# EAGLE design DRV8835-28BYJ (EAGLE 9.6.2)
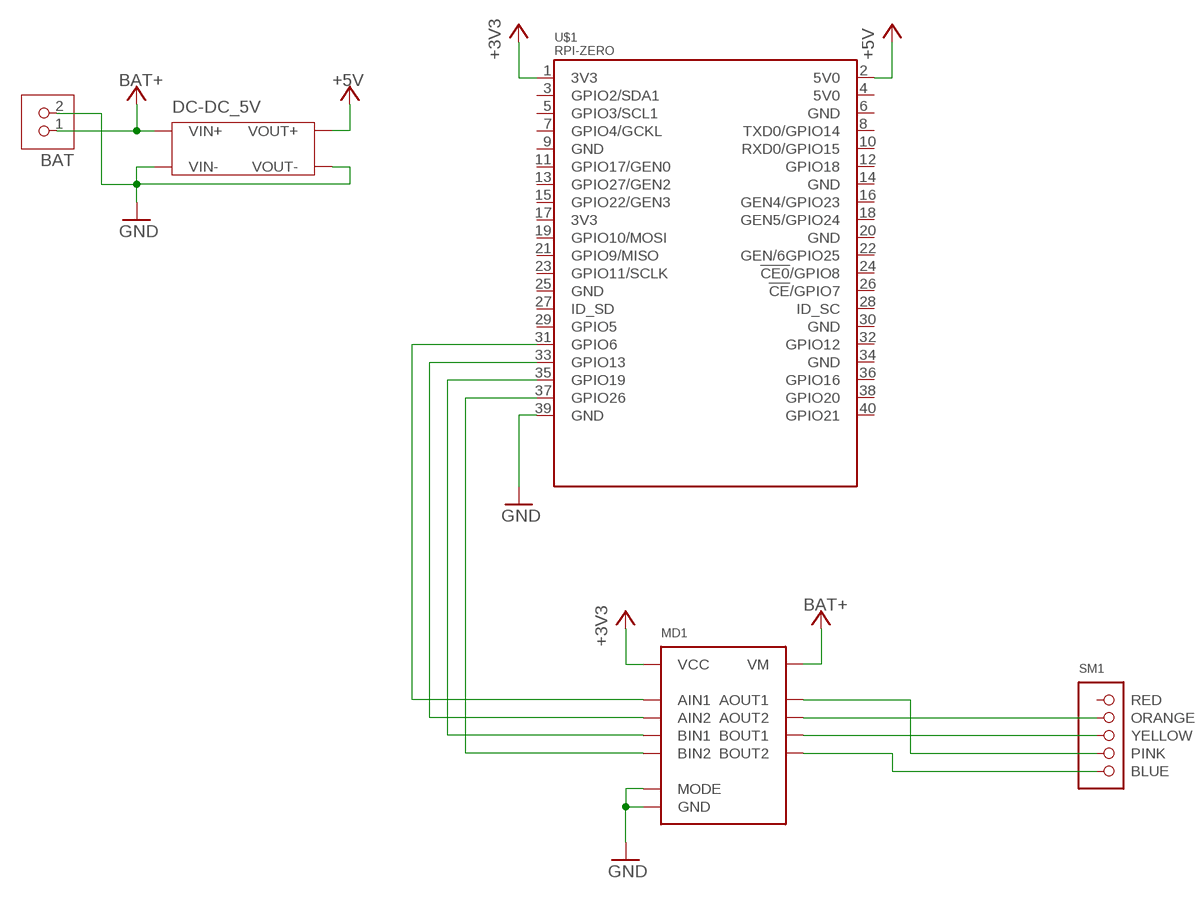
[diagram p0: schematic, sheet 1]

## Parts
BAT  JST-PH2  [JST-PH2]
DC-DC_5V  DCDC-5V_28V-2A  [DCDC-5V_28V-2A]
MD1  DRV8835MOD  [DRV8835MOD]
SM1  28BYJ-48-5V  [28BYJ-48-5V]
U$1  RPI-ZERO  [RASPBERRYPI_BASTELSTUBE_V13_RASPI_BOARD_B+_FULL]

## Nets
+3V3: MD1.VCC U$1.1(3V3)
+5V: DC-DC_5V.VOUT+ U$1.2(5V0)
BAT+: BAT.1 DC-DC_5V.VIN+ MD1.VM
BLUE: MD1.BOUT2 SM1.BLUE
GND: BAT.2 DC-DC_5V.VIN- DC-DC_5V.VOUT- MD1.GND MD1.MODE U$1.39(GND)
GPIO6: MD1.AIN1 U$1.31(GPIO6)
GPIO13: MD1.AIN2 U$1.33(GPIO13)
GPIO19: MD1.BIN1 U$1.35(GPIO19)
GPIO26: MD1.BIN2 U$1.37(GPIO26)
ORANGE: MD1.AOUT2 SM1.ORANGE
PINK: MD1.AOUT1 SM1.PINK
YELLOW: MD1.BOUT1 SM1.YELLOW
Unconnected: SM1.RED U$1.3(GPIO2/SDA1) U$1.4(5V0) U$1.5(GPIO3/SCL1) U$1.6(GND) U$1.7(GPIO4/GCKL) U$1.8(TXD0/GPIO14) U$1.9(GND) U$1.10(RXD0/GPIO15) U$1.11(GPIO17/GEN0) U$1.12(GPIO18) U$1.13(GPIO27/GEN2) U$1.14(GND) U$1.15(GPIO22/GEN3) U$1.16(GEN4/GPIO23) U$1.17(3V3) U$1.18(GEN5/GPIO24) U$1.19(GPIO10/MOSI) U$1.20(GND) U$1.21(GPIO9/MISO) U$1.22(GEN/6GPIO25) U$1.23(GPIO11/SCLK) U$1.24(!CE0!/GPIO8) U$1.25(GND) U$1.26(!CE!/GPIO7) U$1.27(ID_SD) U$1.28(ID_SC) U$1.29(GPIO5) U$1.30(GND) U$1.32(GPIO12) U$1.34(GND) U$1.36(GPIO16) U$1.38(GPIO20) U$1.40(GPIO21)

## Library data of the parts
BAT = ytani1:JST-PH2
DC-DC_5V = ytani1:DCDC-5V_28V-2A: Step-Up DC/DC converter https://www.amazon.co.jp/gp/product/B01D0WSBGY/ In 2V-24V Out 5V-28V = [VALUE] Max: 2A (1A recomended); URL_AMAZON: https://www.amazon.co.jp/gp/product/B01D0WSBGY/
MD1 = ytani1:DRV8835MOD: DRV8835 Motor Driver Module https://akizukidenshi.com/catalog/g/gK-09848/ Vcc = 2V-7V Vm = 0V-11V Iout = 0V-1.5A Fpwm = 0Hz-250kHz Vin = 0V-Vcc; OC_AKIZUKI: K-09848
SM1 = ytani1:28BYJ-48-5V
U$1 = RPI-Zero:RPI-ZERO

## Board
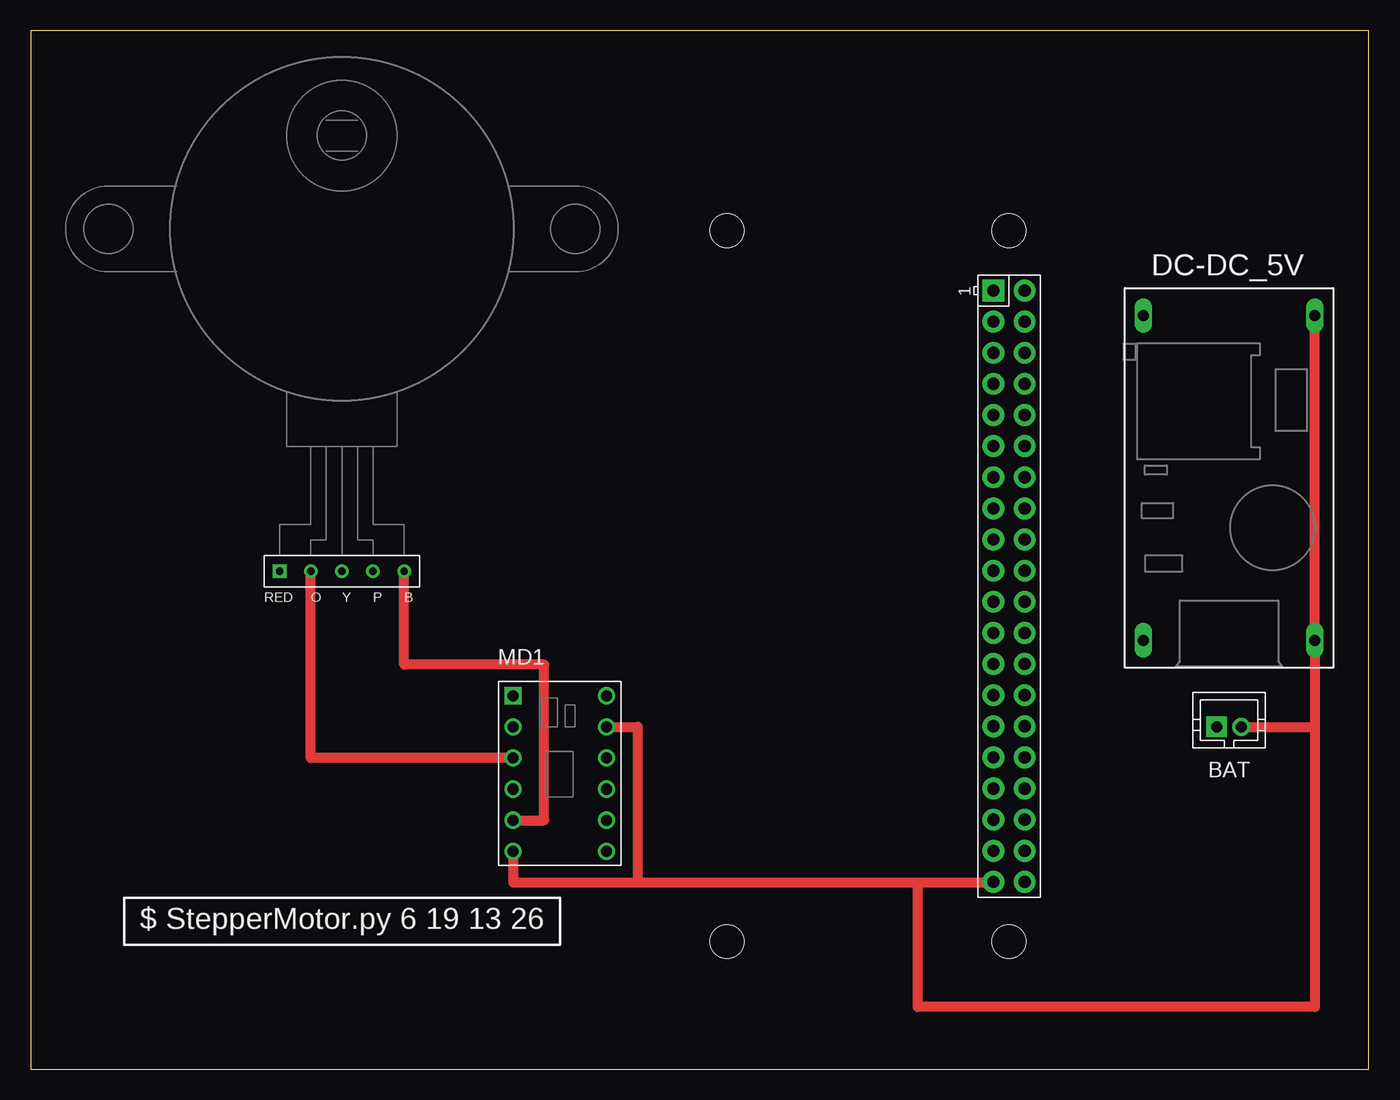
[diagram p1: board, top side]
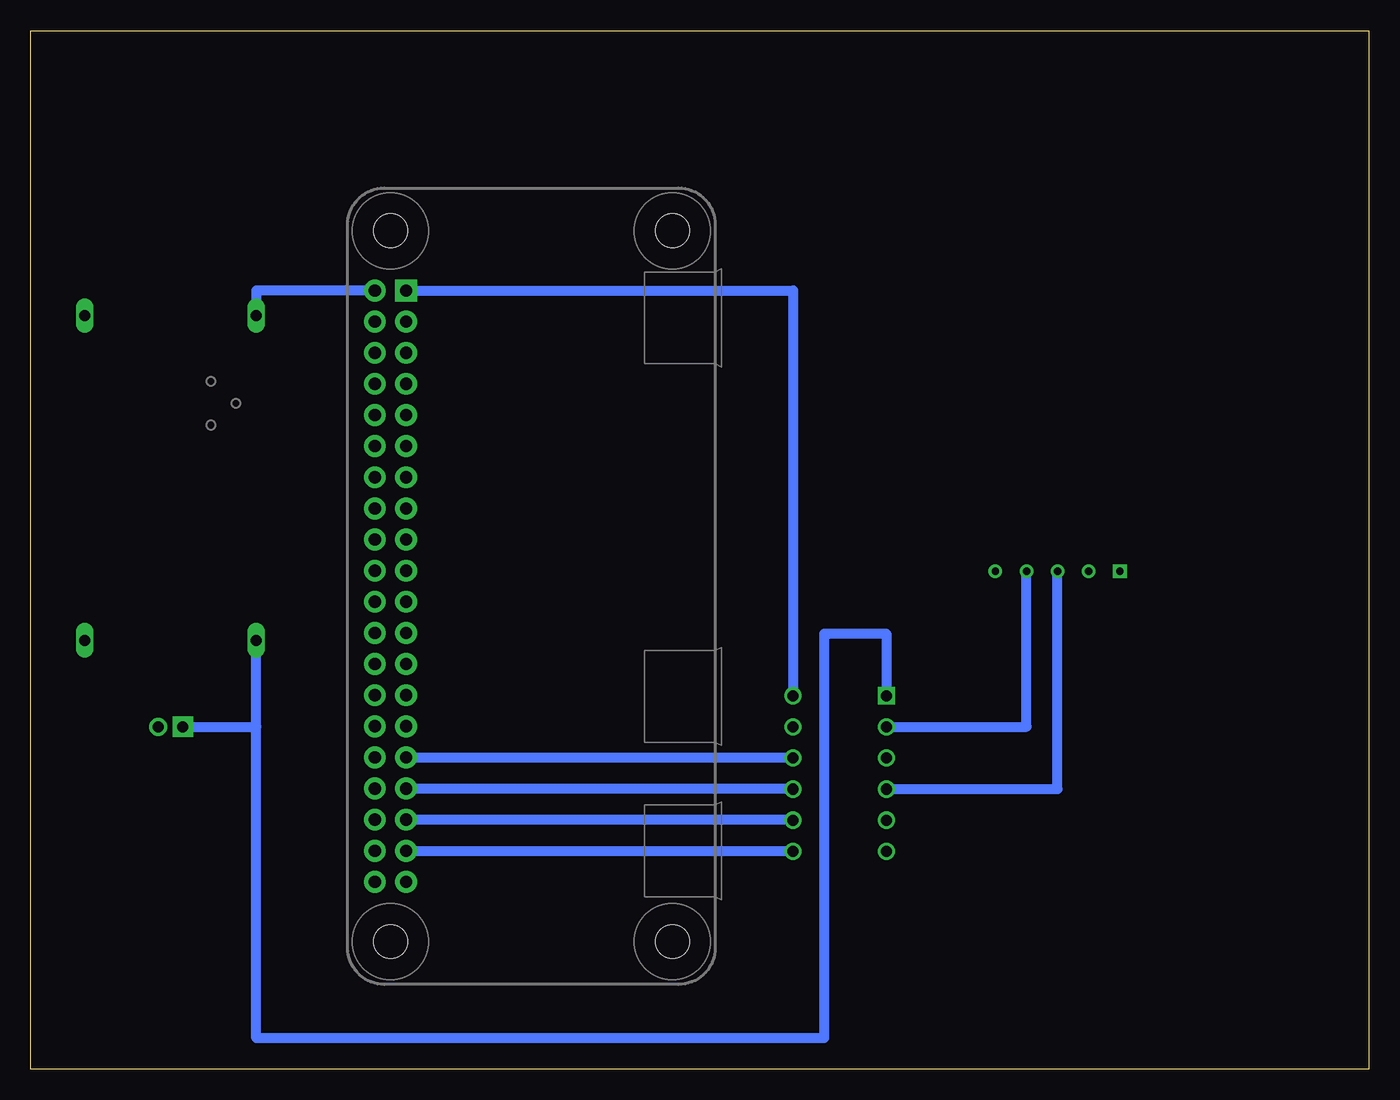
[diagram p2: board, bottom side, seen from below]

Size 109.2 x 84.76 mm. Coordinates in mm from the lower left corner, seen from the top.
Outline: 0,0 109.2,0 109.2,84.76 0,84.76 0,0
Copper layers (1*16): Top 0.035mm / dielectric 1.5mm / Bottom 0.035mm
Design rules "default": minimum track width 6mil, minimum drill 0.35mm, track to track 6mil, track to pad 6mil, pad to pad 6mil, via to via 6mil, smd to smd 6mil, copper to edge 40mil, drill to drill 6mil, minimum pad ring 10mil, minimum via ring 8mil, stop-mask expansion 4mil, vias tented up to drill 0mil, thermal gap 10mil

### Footprints (pad centres in the part's own frame; a part is rotated, then mirrored left to right if it is on the bottom)
JST-PH2 = drill 0.9 pad 1.676 square: 1 -1,0 | drill 0.9 pad 1.5: 2 1,0
DCDC-5V_28V-2A = drill 0.9 long: VIN+ -13.25,7; VIN- -13.25,-7; VOUT+ 13.25,7; VOUT- 13.25,-7
DRV8835MOD = drill 0.9: AIN1 5.08,5.08; AIN2 5.08,2.54; AOUT1 -2.54,7.62; AOUT2 -2.54,5.08; BIN1 5.08,0; BIN2 5.08,-2.54; BOUT1 -2.54,2.54; BOUT2 -2.54,0; GND -2.54,-2.54; MODE 5.08,7.62; VCC 5.08,10.16 | drill 0.9 square: VM -2.54,10.16
28BYJ-48-5V = drill 0.6: BLUE 5.08,-27.94; ORANGE -2.54,-27.94; PINK 2.54,-27.94; YELLOW 0,-27.94 | drill 0.6 square: RED -5.08,-27.94
RASPBERRYPI_BASTELSTUBE_V13_RASPI_BOARD_B+_FULL = drill 1 pad 1.778 square: 1 8.37,25.23 | drill 1 pad 1.778: 2 8.37,27.77; 3 10.91,25.23; 4 10.91,27.77; 5 13.45,25.23; 6 13.45,27.77; 7 15.99,25.23; 8 15.99,27.77; 9 18.53,25.23; 10 18.53,27.77; 11 21.07,25.23; 12 21.07,27.77; 13 23.61,25.23; 14 23.61,27.77; 15 26.15,25.23; 16 26.15,27.77; 17 28.69,25.23; 18 28.69,27.77; 19 31.23,25.23; 20 31.23,27.77; 21 33.77,25.23; 22 33.77,27.77; 23 36.31,25.23; 24 36.31,27.77; 25 38.85,25.23; 26 38.85,27.77; 27 41.39,25.23; 28 41.39,27.77; 29 43.93,25.23; 30 43.93,27.77; 31 46.47,25.23; 32 46.47,27.77; 33 49.01,25.23; 34 49.01,27.77; 35 51.55,25.23; 36 51.55,27.77; 37 54.09,25.23; 38 54.09,27.77; 39 56.63,25.23; 40 56.63,27.77 | hole 2.75: 3.5,3.5; 3.5,26.5; 61.5,3.5; 61.5,26.5

### Placement (x,y rotation side)
BAT  97.79,27.94 0 top
DC-DC_5V  97.79,48.26 90 top
MD1  41.91,20.32 0 top
SM1  25.4,68.58 0 top
U$1  53.34,71.92 270 top

### Tracks (layer width: path | path; a pad name or v marks a point on that pad's centre or on a via)
+3V3
  Bottom 0.813: U$1.1 46.99,63.55 MD1.VCC
+5V
  Bottom 0.813: U$1.2 90.79,63.55 DC-DC_5V.VOUT+
BAT+
  Bottom 0.813: MD1.VM 39.37,35.56 44.45,35.56 44.45,2.54 90.79,2.54 90.79,27.94 | BAT.1 90.79,27.94 | 90.79,27.94 DC-DC_5V.VIN+
BLUE
  Top 0.813: MD1.BOUT2 41.91,20.32 41.91,33.02 30.48,33.02 SM1.BLUE
GND
  Top 0.813: MD1.GND 39.37,15.24 49.53,15.24 | 49.53,15.24 72.39,15.24 | 72.39,15.24 78.57,15.24 U$1.39 | MD1.MODE 49.53,27.94 49.53,15.24 | DC-DC_5V.VOUT- DC-DC_5V.VIN- 104.79,27.94 | BAT.2 104.79,27.94 | 104.79,27.94 104.79,5.08 72.39,5.08 72.39,15.24
GPIO6
  Bottom 0.813: MD1.AIN1 78.57,25.4 U$1.31
GPIO13
  Bottom 0.813: MD1.AIN2 78.57,22.86 U$1.33
GPIO19
  Bottom 0.813: MD1.BIN1 46.99,20.37 U$1.35
GPIO26
  Bottom 0.813: MD1.BIN2 78.57,17.78 U$1.37
ORANGE
  Top 0.813: MD1.AOUT2 22.86,25.4 SM1.ORANGE
PINK
  Bottom 0.813: MD1.AOUT1 27.94,27.94 SM1.PINK
YELLOW
  Bottom 0.813: MD1.BOUT1 25.4,22.86 SM1.YELLOW

### Text on the board
tPlace: $ StepperMotor.py 6 19 13 26